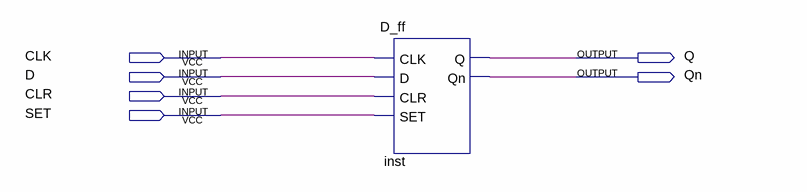
[diagram p0: schematic sheet]
// Quartus schematic dfftester.bdf as structural Verilog: 1 symbols, 6 pins
module dfftester (
  input  CLK,
  input  D,
  input  CLR,
  input  SET,
  output Q,
  output Qn
);

  D_ff inst (.CLK(CLK), .D(D), .CLR(CLR), .SET(SET), .Q(Q), .Qn(Qn));
endmodule
